# Altium schematic sheet USB.schdoc
size 127 x 99 mm
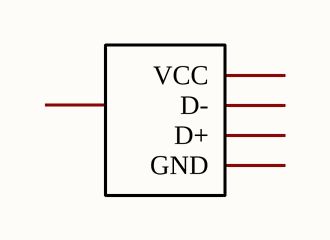
[diagram p0: USB.schdoc]

## Parts
USB?  AF 90° WJDG  [USB-A-TH_AF-WJDG]  (value not drawn)

## Nets

Not connected (* = marked no-connect by the designer): USB? 1(VCC) 2(D-) 3(D+) 4(GND) 5(SHLD)

## Library data of the parts
USB? = AF 90° WJDG: Manufacturer: SHOU HAN(首韩); Add into BOM: yes; Connector Type: Type-A; Gender: 母; Number of Ports: 1; Number of Contacts: 4P; Current Rating - Power (Max): 1.5A; Symbol: AF 90° WJDG; Device: AF 90° WJDG; Supplier: LCSC; Supplier Part: C456018; Manufacturer Part: AF 90° WJDG; JLCPCB Part Class: Extended Part; LCSC Part Name: Type-A 母 弯插; Supplier Footprint: 插件; Datasheet: https://atta.szlcsc.com/upload/public/pdf/source/20191113/C456018_B104E062BEB8E11E57E63560E04EE13A.pdf; Convert to PCB: yes; Standard: USB 2.0; Mounting Style: 弯插; Operating Temperature Range: -25℃~+85℃